# Altium project BLDC-Board-v1.0.PrjPcb (part 2 of 3)

## Sheet Controller_Sheet.SchDoc
size 420 x 297 mm; SheetNumber: 3; SheetTotal: 8
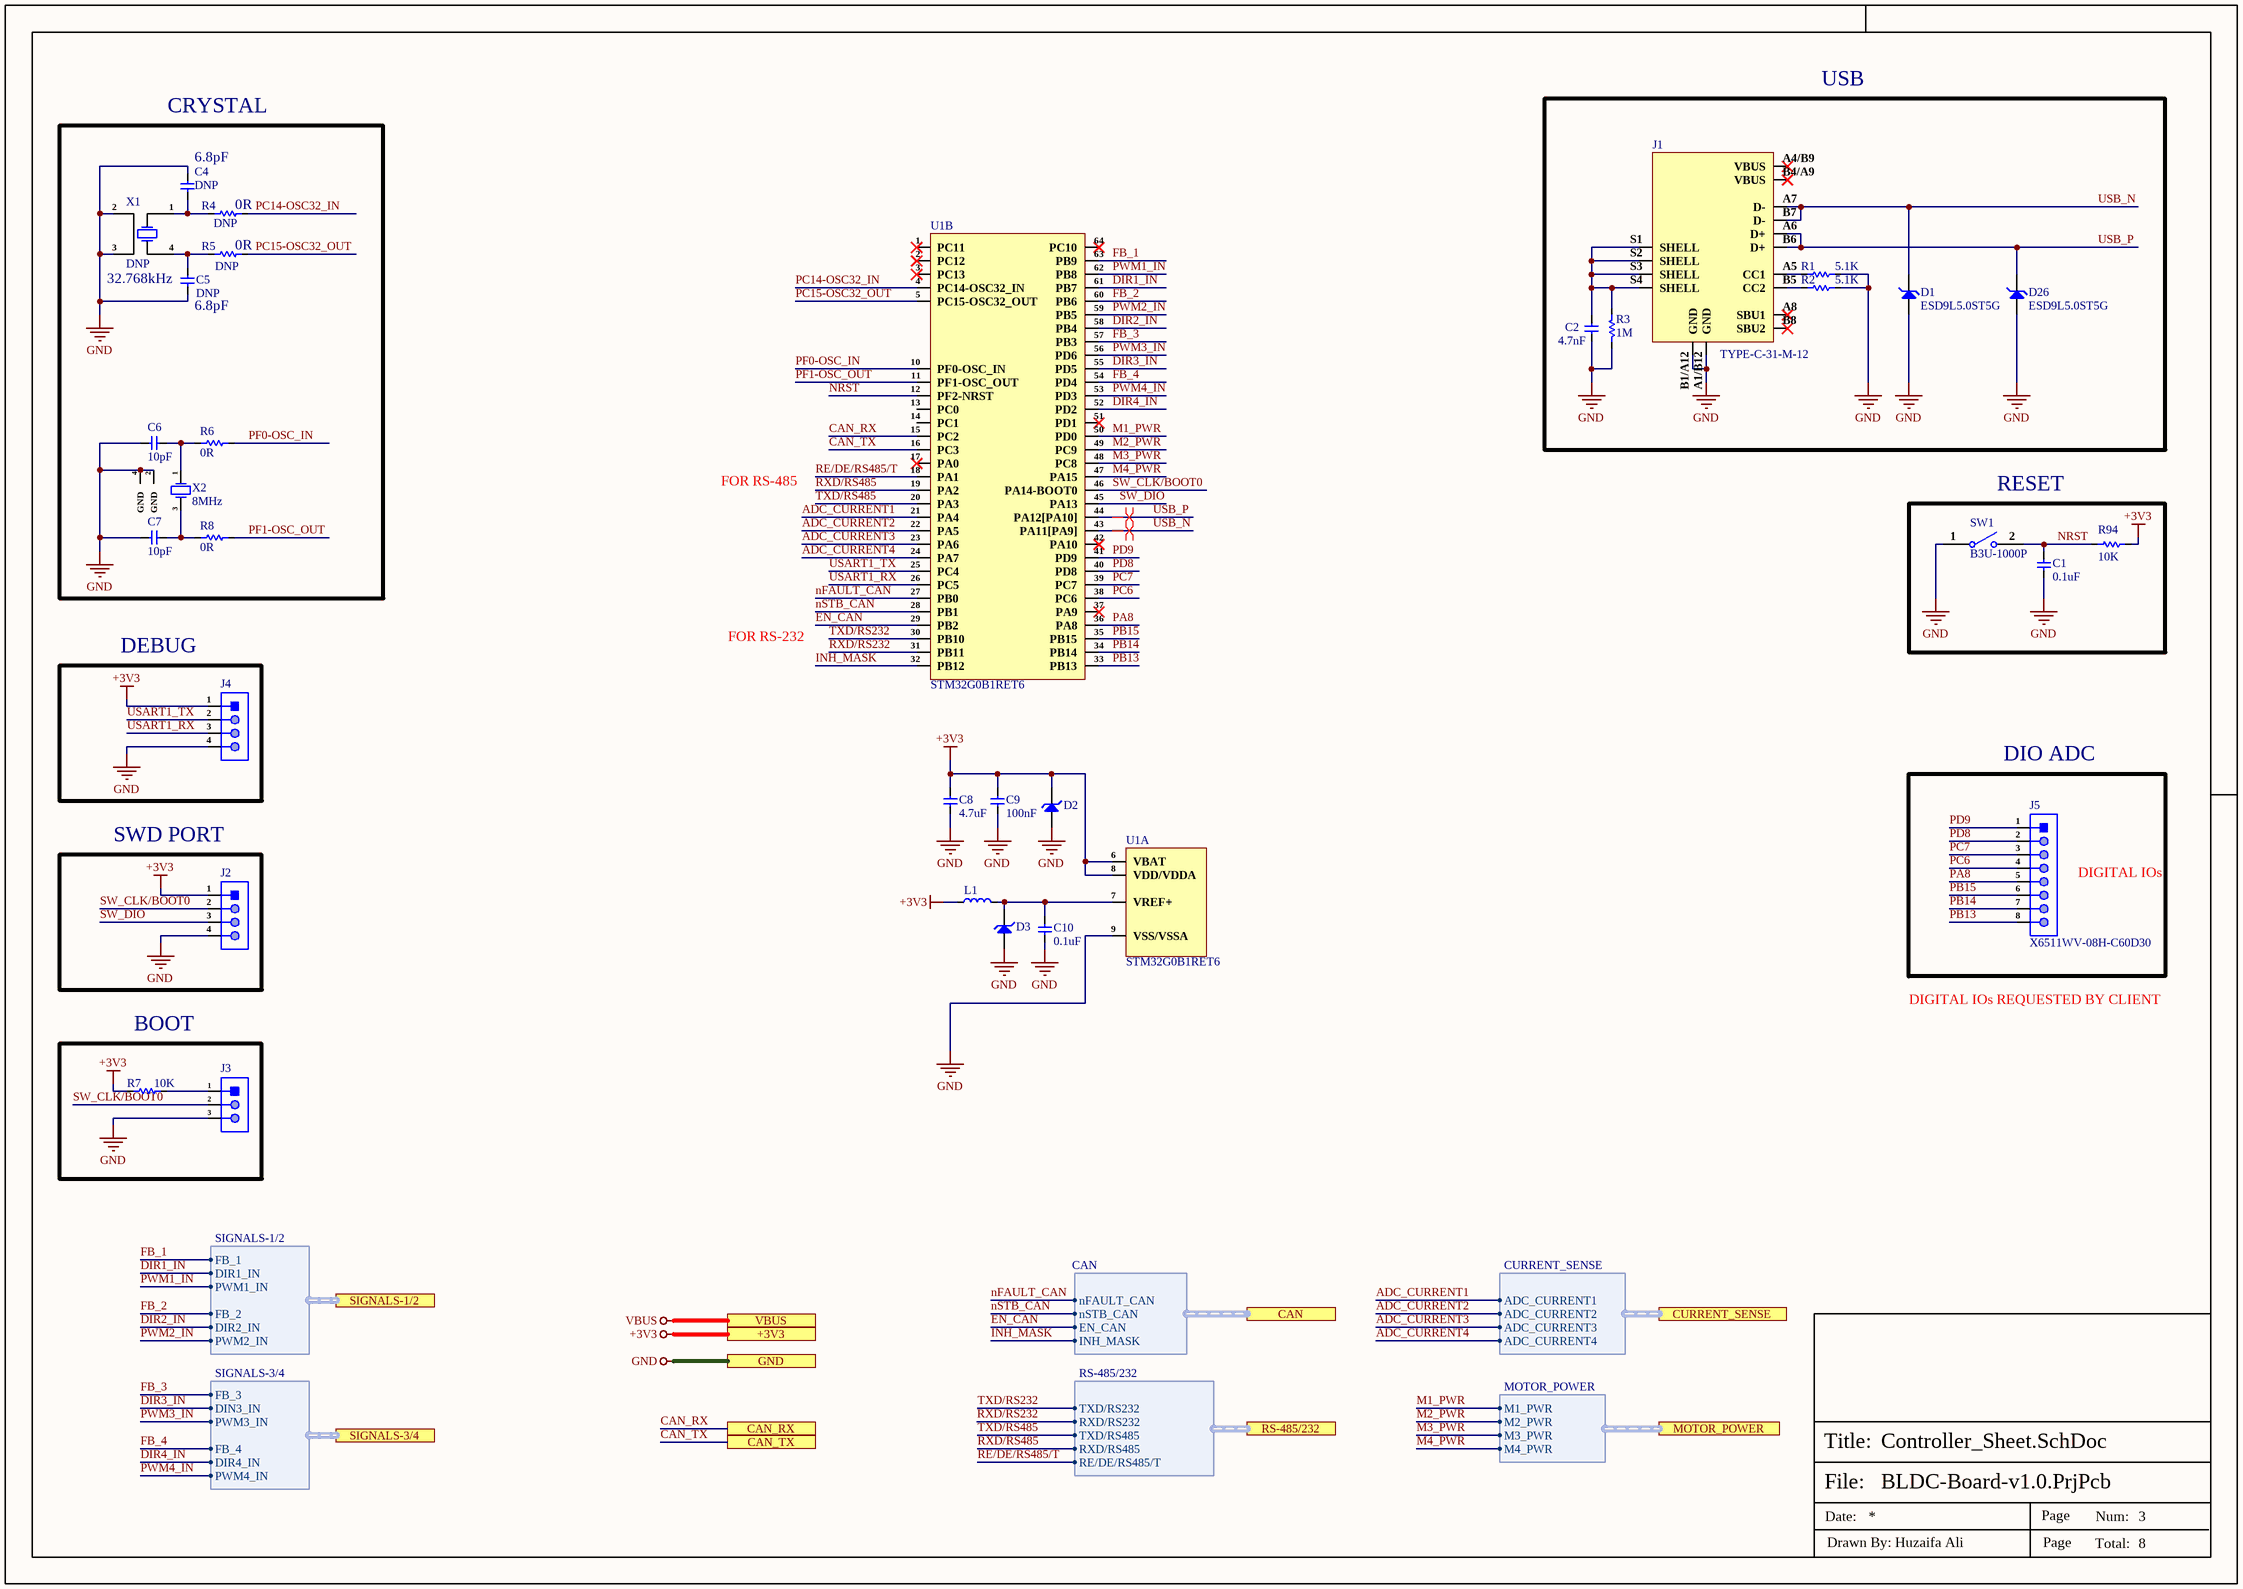
[diagram p4: Controller_Sheet.SchDoc]

### Parts
C1  0.1uF  [Cap-0402]
C2  4.7nF  [Cap-0603]
C4  DNP  [Cap-0402]
C5  DNP  [Cap-0402]
C6  10pF  [Cap-0402]
C7  10pF  [Cap-0402]
C8  4.7uF  [Cap-0402]
C9  100nF  [cap-0402]
C10  0.1uF  [Cap-0402]
D1  ESD9L5.0ST5G  [SOD-923.]
D2  AZ3003-01G  [SOD-123]  (value not drawn)
D3  AZ3003-01G  [SOD-123]  (value not drawn)
D26  ESD9L5.0ST5G  [SOD-923.]
J1  TYPE-C-31-M-12  [TYPE-C-31-M-12_]
J2  X6511WV-04H-C60D30  [HDR1X4_]  (value not drawn)
J3  68000-103HLF  [HDR1X3_]  (value not drawn)
J4  X6511WV-04H-C60D30  [HDR1X4_]  (value not drawn)
J5  X6511WV-08H-C60D30  [HDR 1x8 TH male]
L1  BLM15AG601SN1D  [IND-0402]  (value not drawn)
R1  5.1K  [Res-0402]
R2  5.1K  [Res-0402]
R3  1M  [Res-0402]
R4  DNP  [Res-0603]
R5  DNP  [Res-0603]
R6  0R  [Res-0603]
R7  10K  [Res-0402]
R8  0R  [Res-0603]
R94  10K  [Res-0402]
SW1  B3U-1000P  [B3U-1000P]
U1  STM32G0B1RET6  [LQFP-64(10x10)]  (parts A,B of 2)
X1  DNP  [MC-306]
X2  8MHz  [5TJ480000XYLBC_]

### Blocks framed on the sheet
USB: C2 D1 D26 J1 R1-R3
CRYSTAL: C4-C7 R4-R6 R8 X1 X2
RESET: C1 R94 SW1
DEBUG: J4
DIO ADC: J5
SWD PORT: J2
BOOT: J3 R7

### Ports
+3V3 (see Top_Sheet[3A], CAN_Sheet[5D], Connector_Sheet1[5D], Connector_Sheet2[3D], Motor_Driver_Sheet[5D], Power_Sheet[5D], RS485_RS232_Sheet[5D]), CAN (harness CAN, see Top_Sheet[4B], CAN_Sheet[3D]), CAN_RX (see Top_Sheet[4B], CAN_Sheet[2D]), CAN_TX (see Top_Sheet[4B], CAN_Sheet[2D]), CURRENT_SENSE (harness CURRENT_SENSE, see Top_Sheet[3B], Motor_Driver_Sheet[4D]), GND (see Top_Sheet[3B], CAN_Sheet[5D], Connector_Sheet1[5D], Connector_Sheet2[3D], Motor_Driver_Sheet[5D], Power_Sheet[5D], RS485_RS232_Sheet[5D]), MOTOR_POWER (harness MOTOR_POWER, see Top_Sheet[3B], Motor_Driver_Sheet[6D]), RS-485/232 (harness RS-485/232, see Top_Sheet[4B], RS485_RS232_Sheet[2D]), SIGNALS-1/2 (harness SIGNALS-1/2, see Top_Sheet[3B], Connector_Sheet1[1D]), SIGNALS-3/4 (harness SIGNALS-3/4, see Top_Sheet[4B], Connector_Sheet2[4D]), VBUS (see Top_Sheet[3A])

### Harnesses
CURRENT_SENSE: ADC_CURRENT1, ADC_CURRENT2, ADC_CURRENT3, ADC_CURRENT4
MOTOR_POWER: M1_PWR, M2_PWR, M3_PWR, M4_PWR
CAN: nFAULT_CAN, nSTB_CAN, EN_CAN, INH_MASK
RS-485/232: TXD/RS232, RXD/RS232, TXD/RS485, RXD/RS485, RE/DE/RS485/T
SIGNALS-3/4: FB_3, DIN3_IN, PWM3_IN, FB_4, DIR4_IN, PWM4_IN
SIGNALS-1/2: FB_1, DIR1_IN, PWM1_IN, FB_2, DIR2_IN, PWM2_IN

### Nets
+3V3: C8.2 C9.2 D2.2(K) J2.1 J4.1 L1.1 R7.2 R94.2 U1.6(VBAT) U1.8(VDD/VDDA) ; port +3V3
GND: C1.1 C2.1 C4.1 C5.2 C6.2 C7.2 C8.1 C9.1 C10.1 D1.2(A) D2.1(A) D3.1(A) D26.2(A) J1.A1/B12(GND) J1.B1/A12(GND) J2.4 J3.3 J4.4 R1.2 R2.2 R3.2 SW1.1 U1.9(VSS/VSSA) X1.2 X1.3 X2.2(GND) X2.4(GND) ; port GND
VBUS: port VBUS
ADC_CURRENT1: U1.21(PA4) ; port CURRENT_SENSE.ADC_CURRENT1
ADC_CURRENT2: U1.22(PA5) ; port CURRENT_SENSE.ADC_CURRENT2
ADC_CURRENT3: U1.23(PA6) ; port CURRENT_SENSE.ADC_CURRENT3
ADC_CURRENT4: U1.24(PA7) ; port CURRENT_SENSE.ADC_CURRENT4
CAN_RX: U1.15(PC2) ; port CAN_RX
CAN_TX: U1.16(PC3) ; port CAN_TX
DIR1_IN: U1.61(PB7) ; port SIGNALS-1/2.DIR1_IN
DIR2_IN: U1.58(PB4) ; port SIGNALS-1/2.DIR2_IN
DIR3_IN: U1.55(PD5) ; port SIGNALS-3/4.DIN3_IN
DIR4_IN: U1.52(PD2) ; port SIGNALS-3/4.DIR4_IN
EN_CAN: U1.29(PB2) ; port CAN.EN_CAN
FB_1: U1.63(PB9) ; port SIGNALS-1/2.FB_1
FB_2: U1.60(PB6) ; port SIGNALS-1/2.FB_2
FB_3: U1.57(PB3) ; port SIGNALS-3/4.FB_3
FB_4: U1.54(PD4) ; port SIGNALS-3/4.FB_4
INH_MASK: U1.32(PB12) ; port CAN.INH_MASK
M1_PWR: U1.50(PD0) ; port MOTOR_POWER.M1_PWR
M2_PWR: U1.49(PC9) ; port MOTOR_POWER.M2_PWR
M3_PWR: U1.48(PC8) ; port MOTOR_POWER.M3_PWR
M4_PWR: U1.47(PA15) ; port MOTOR_POWER.M4_PWR
nFAULT_CAN: U1.27(PB0) ; port CAN.nFAULT_CAN
NRST: C1.2 R94.1 SW1.2 U1.12(PF2-NRST)
nSTB_CAN: U1.28(PB1) ; port CAN.nSTB_CAN
PA8: J5.5 U1.36(PA8)
PB13: J5.8 U1.33(PB13)
PB14: J5.7 U1.34(PB14)
PB15: J5.6 U1.35(PB15)
PC6: J5.4 U1.38(PC6)
PC7: J5.3 U1.39(PC7)
PC14-OSC32_IN: R4.2 U1.4(PC14-OSC32_IN)
PC15-OSC32_OUT: R5.2 U1.5(PC15-OSC32_OUT)
PD8: J5.2 U1.40(PD8)
PD9: J5.1 U1.41(PD9)
PF0-OSC_IN: R6.2 U1.10(PF0-OSC_IN)
PF1-OSC_OUT: R8.2 U1.11(PF1-OSC_OUT)
PWM1_IN: U1.62(PB8) ; port SIGNALS-1/2.PWM1_IN
PWM2_IN: U1.59(PB5) ; port SIGNALS-1/2.PWM2_IN
PWM3_IN: U1.56(PD6) ; port SIGNALS-3/4.PWM3_IN
PWM4_IN: U1.53(PD3) ; port SIGNALS-3/4.PWM4_IN
RE/DE/RS485/T: U1.18(PA1) ; port RS-485/232.RE/DE/RS485/T
RXD/RS232: U1.31(PB11) ; port RS-485/232.RXD/RS232
RXD/RS485: U1.19(PA2) ; port RS-485/232.RXD/RS485
SW_CLK/BOOT0: J2.2 J3.2 U1.46(PA14-BOOT0)
SW_DIO: J2.3 U1.45(PA13)
TXD/RS232: U1.30(PB10) ; port RS-485/232.TXD/RS232
TXD/RS485: U1.20(PA3) ; port RS-485/232.TXD/RS485
USART1_RX: J4.3 U1.26(PC5)
USART1_TX: J4.2 U1.25(PC4)
USB_N: D1.1(K) J1.A7(D-) J1.B7(D-) U1.43(PA11[PA9])
USB_P: D26.1(K) J1.A6(D+) J1.B6(D+) U1.44(PA12[PA10])
NetC2_2: C2.2 J1.S1(SHELL) J1.S2(SHELL) J1.S3(SHELL) J1.S4(SHELL) R3.1
NetC4_2: C4.2 R4.1 X1.1(OSC1)
NetC5_1: C5.1 R5.1 X1.4(OSC2)
NetC6_1: C6.1 R6.1 X2.1(OSC1)
NetC7_1: C7.1 R8.1 X2.3(OSC2)
NetC10_2: C10.2 D3.2(K) L1.2 U1.7(VREF+)
NetJ1_A5: J1.A5(CC1) R1.1
NetJ1_B5: J1.B5(CC2) R2.1
NetJ3_1: J3.1 R7.1

Not connected (* = marked no-connect by the designer): J1 A4/B9(VBUS)* A8(SBU1)* B4/A9(VBUS)* B8(SBU2)*; U1 1(PC11)* 2(PC12)* 3(PC13)* 13(PC0) 14(PC1) 17(PA0)* 37(PA9)* 42(PA10)* 51(PD1)* 64(PC10)*

### Layout directives
differential pair; net class USB_PROGRAM; differential pair class USB_PROGRAM_LINES; rule Impedance Constraint [Min = 85.00    Max = 90.00    ]; rule Matched Net Lengths [Tolerance = 50mil]: USB_N, USB_P

### Notes on the sheet
- (near C4) 6.8pF
- (near R5) 0R
- (near R4) 0R
- 32.768kHz
- (near C5) 6.8pF
- FOR RS-485
- FOR RS-232
- (near J5) DIGITAL IOs
- DIGITAL IOs REQUESTED BY CLIENT
- File:
- Title:
- Date:
- Page
- Num:
- Total:
- Drawn By: Huzaifa Ali

### Library data of the parts
C1 C10 = CC0402JRX7R7BB104: CAP CER 0.1UF 16V X7R 0402; Manufacturer: Yageo; Material: 4241ConductorMaterial; Value: 100nF; Tolerance: 5%; Item Type: Capacitor; Supplier: Digikey; Supplier Part Number: 311-1676-1-ND; Manufacturer Part Number: CC0402JRX7R7BB104; RoHS: Yes; Category: Ceramic Capacitors; Stock: 1659111; Pricing: 1=0.1, 10=0.046, 50=0.0262, 100=0.0203, 500=0.01528, 1000=0.012, 2500=0.01091, 5000=0.01004 (USD); Mounting Technology: Surface Mount; Case/Package: 0402; Case Code (Metric): 1005; Case Code (Imperial): 0402; Min Operating Temperature: -55°C; Max Operating Temperature: 125°C; Dielectric: X7R; Packaging: Tape and Reel; Package Quantity: 10000; Voltage Rating (DC): 16V; Voltage Rating: 16V; Series: CC; Construction: Flat; Length: 0.039inch; Width: 0.02inch; Height: 0.5mm; Thickness: 0.022inch; Lead Free: Lead Free; Halogen Free: Halogen Free; RoHS Compliant: Yes; ComponentLink1URL: https://datasheet.ciiva.com/13210/upy-gphc-x7r-6-3v-to-50v-8-12304-13210152.pdf?src-supplier=Mouser; ComponentLink1Description: https://datasheet.ciiva.com/13210/upy-gphc-x7r-6-3v-to-50v-8-12304-13210152.pdf?src-supplier=Mouser; LCSC Part Number: C541464
C2 = CC0603JRNPO9BN472: CAP CER 4700PF 50V C0G/NPO 0603; Manufacturer: Yageo; Item Type: Capacitor; Supplier 1: Digi-Key; Manufacturer Part Number: CC0603JRNPO9BN472; RoHS: Yes; Category: Ceramic Capacitors; Stock 1: 31779; Pricing 1: 1=0.48000, 10=0.33000, 50=0.23100, 100=0.19800, 500=0.14854, 1000=0.12543 (USD); RoHS Compliant: Yes; Supplier Part Number 1: 13-CC0603JRNPO9BN472CT-ND; LCSC Part Number: C576818; ComponentLink1Description: LCSC; ComponentLink1URL: https://www.lcsc.com/product-detail/Multilayer-Ceramic-Capacitors-MLCC-SMD-SMT_YAGEO-CC0603JRNPO9BN472_C576818.html
C4 C5 = CC0402CRNPO9BN6R8: CAP CER 6.8PF 50V C0G/NPO 0402; Manufacturer: Yageo; Dielectric: C0G; Tolerance: 2%; Insulation Resistance: 10GR; Item Type: Capacitor; Supplier: Future Electronics; Supplier Part Number: 3247368; Manufacturer Part Number: CC0402CRNPO9BN6R8; RoHS: Yes; Category: Ceramic Capacitors; Stock: 200000; Pricing: 10000=0.0024, 40000=0.0022, 150000=0.0021, 400000=0.002, 1000000=0.0019 (USD); Mounting Technology: Surface Mount; Case/Package: 0402; Case Code (Imperial): 0402; Case Code (Metric): 1005; Weight: 2.3E-05oz; Min Operating Temperature: -55°C; Max Operating Temperature: 125°C; Value: 6.8pF; Packaging: Tape and Reel; Voltage Rating: 50V; Voltage Rating (DC): 50V; Termination: SMD/SMT; Series: CC; Construction: Flat; Length: 1mm; Width: 0.5mm; Height: 0.5mm; Depth: 0.5mm; Radiation Hardening: No; RoHS Compliant: Yes; ComponentLink1URL: https://datasheet.ciiva.com/11587/upy-gp-np0-16v-to-50v-8-11587182.pdf?src-supplier=Avnet; ComponentLink1Description: https://datasheet.ciiva.com/11587/upy-gp-np0-16v-to-50v-8-11587182.pdf?src-supplier=Avnet; LCSC Part Number: C189470
C6 C7 = GRM1555C1H100JA01D: CAP CER 10PF 50V C0G/NP0 0402; Manufacturer: Murata; Material: Ceramic; Dielectric: C0G; Tolerance: 5%; Item Type: Capacitor; Supplier: Arrow Electronics; Supplier Part Number: GRM1555C1H100JA01D; Manufacturer Part Number: GRM1555C1H100JA01D; RoHS: Yes; Category: Ceramic Capacitors; Stock: 3860000; Pricing: 10000=0.0034, 50000=0.0027, 100000=0.0023, 250000=0.0021 (USD); Mounting Technology: Surface Mount; Case/Package: 0402; Case Code (Metric): 1005; Case Code (Imperial): 0402; Min Operating Temperature: -55°C; Max Operating Temperature: 125°C; Value: 10pF; Voltage Rating: 50V; Packaging: Tape and Reel; Package Quantity: 1; Voltage Rating (DC): 50V; Termination: SMD/SMT; Series: GRM; Voltage: 50V; Construction: Flat; Length: 1mm; Width: 0.02inch; Height: 0.5mm; Depth: 0.5mm; Thickness: 0.022inch; Radiation Hardening: No; RoHS Compliant: Yes; Lead Free: Lead Free; Reach SVHC Compliant: No; ComponentLink1URL: https://datasheet.ciiva.com/2989/product-2989280.pdf?src-supplier=Avnet; ComponentLink1Description: https://datasheet.ciiva.com/2989/product-2989280.pdf?src-supplier=Avnet; ComponentLink2URL: https://datasheet.ciiva.com/18184/getdatasheetpartid-307234-18184164.pdf?src-supplier=Verical; ComponentLink2Description: https://datasheet.ciiva.com/18184/getdatasheetpartid-307234-18184164.pdf?src-supplier=Verical; ComponentLink3URL: https://datasheet.ciiva.com/29200/453545-da-01-en-vs-kondensator-0402-29200107.pdf?src-supplier=Conrad; ComponentLink3Description: https://datasheet.ciiva.com/29200/453545-da-01-en-vs-kondensator-0402-29200107.pdf?src-supplier=Conrad; ComponentLink4URL: https://datasheet.ciiva.com/7828/1666664-7828812.pdf?src-supplier=Element14; ComponentLink4Description: https://datasheet.ciiva.com/7828/1666664-7828812.pdf?src-supplier=Element14; ComponentLink5URL: https://datasheet.ciiva.com/6271/partnumbering-e-01-6271159.pdf?src-supplier=Digi-Key; ComponentLink5Description: https://datasheet.ciiva.com/6271/partnumbering-e-01-6271159.pdf?src-supplier=Digi-Key; ComponentLink6URL: https://datasheet.ciiva.com/6271/partnumbering-e-01-6271158.pdf?src-supplier=Digi-Key; ComponentLink6Description: https://datasheet.ciiva.com/6271/partnumbering-e-01-6271158.pdf?src-supplier=Digi-Key; ComponentLink7URL: https://datasheet.ciiva.com/6271/partnumbering-e-01-6271068.pdf?src-supplier=Digi-Key; ComponentLink7Description: https://datasheet.ciiva.com/6271/partnumbering-e-01-6271068.pdf?src-supplier=Digi-Key; LCSC Part Number: C76946
C8 = CC0402KRX5R6BB475: CAP CER 4.7UF 10V X5R 0402; Manufacturer: Yageo; Tolerance: 10%; Supplier 1: Farnell; Manufacturer Part Number: CC0402KRX5R6BB475; RoHS: Yes; Category: Ceramic Capacitors; Stock 1: 20000; Pricing 1: 10000=0.02310, 50000=0.02100 (GBP); Mount: Surface Mount; Case/Package: 0402; Case Code (Imperial): 0402; Case Code (Metric): 1005; Min Operating Temperature: -55°C; Max Operating Temperature: 85°C; Packaging: Cut Tape; Capacitance: 4.7uF; Voltage Rating: 10V; RoHS Compliant: Yes; ComponentLink1URL: http://www.yageo.com/documents/recent/UPY-GPHC_X5R_4V-to-50V_25.pdf?src-supplier=Digi-Key; ComponentLink1Description: http://www.yageo.com/documents/recent/UPY-GPHC_X5R_4V-to-50V_25.pdf?src-supplier=Digi-Key; Supplier Part Number 1: 3871698; LCSC Part Number: C326586
C9 = C1005X7R1H104KT000F: CAP CER 0.1UF 50V X7R 0402; Manufacturer: TDK; Tolerance: 10%; Voltage: 25V; Item Type: Capacitor; Supplier 1: Avnet; Manufacturer Part Number: C1005X7R1H104KT000F; RoHS: No; Category: Ceramic Capacitors; Dielectric: X7R; Supplier Part Number 1: C1005X7R1H104KT000F; LCSC Part Number: C361198; ComponentLink1Description: LCSC; ComponentLink1URL: https://www.lcsc.com/product-detail/Multilayer-Ceramic-Capacitors-MLCC-SMD-SMT_TDK-C1005X7R1H104KT000F_C361198.html
D1 D26 = ESD9L5.0ST5G: TVS DIODE 5V 9.8V SOD923; Manufacturer: ON Semiconductor; Capacitance: 0.9pF; Direction: Unidirectional; Number of Unidirectional Channels: 1; Min Breakdown Voltage: 5.4V; Power Line Protection: No; Leakage Current: 1uA; Element Configuration: Single; Peak Pulse Current: 1A; Diode Type: ZENER; Reverse Breakdown Voltage: 5.8V; Peak Pulse Power: 150mW; ESD Protection: Yes; Test Current: 1mA; Supplier 1: Digi-Key; Manufacturer Part Number: ESD9L5.0ST5G; RoHS: Yes; Category: ESD and Circuit Protection ICs; Stock 1: 558996; Pricing 1: 1=0.37000, 10=0.25600, 100=0.12500, 500=0.10426, 1000=0.07244, 2000=0.06278 (USD); Case/Package: SOD-923-2; Number of Pins: 2; Contact Plating: Tin,Matte; Min Operating Temperature: -55°C; Max Operating Temperature: 150°C; Package Quantity: 1; Packaging: Tape and Reel; Clamping Voltage: 9.8V; Reverse Standoff Voltage: 5V; Working Voltage: 5V; Resistor Type: Zener; Series: Automotive, AEC-Q101; Number of Elements: 1; Operating Supply Voltage: 5V; Max Surge Current: 1A; Breakdown Voltage: 5.4V; Number of Channels: 1; Polarity: Unidirectional; Termination: SMD/SMT; Max Reverse Leakage Current: 1uA; Max Breakdown Voltage: 5.4V; Number of Lines: 1; Power Dissipation: 150mW; Clamping Voltage-Max: 9.8V; Length: 0.8mm; Width: 0.65mm; Height: 0.4mm; Depth: 0.6mm; Radiation Hardening: No; Lead Free: Lead Free; RoHS Compliant: Yes; REACH SVHC: No SVHC; Halogen Free: Halogen Free; ComponentLink1URL: https://datasheet.ciiva.com/15143/getdatasheetpartid-185186-15143896.pdf?src-supplier=Verical; ComponentLink1Description: https://datasheet.ciiva.com/15143/getdatasheetpartid-185186-15143896.pdf?src-supplier=Verical; ComponentLink2URL: https://datasheet.ciiva.com/4510/esd9l-d-4510647.pdf?src-supplier=Mouser; ComponentLink2Description: https://datasheet.ciiva.com/4510/esd9l-d-4510647.pdf?src-supplier=Mouser; ComponentLink3URL: https://datasheet.ciiva.com/3304/esd9l-d-3304011.pdf?src-supplier=Avnet; ComponentLink3Description: https://datasheet.ciiva.com/3304/esd9l-d-3304011.pdf?src-supplier=Avnet; ComponentLink4URL: https://datasheet.ciiva.com/16437/esd9l-d-16437835.pdf?src-supplier=Future+Electronics; ComponentLink4Description: https://datasheet.ciiva.com/16437/esd9l-d-16437835.pdf?src-supplier=Future+Electronics; ComponentLink5URL: https://datasheet.ciiva.com/339/esd9l-d-339853.pdf?src-supplier=Digi-Key; ComponentLink5Description: https://datasheet.ciiva.com/339/esd9l-d-339853.pdf?src-supplier=Digi-Key; ComponentLink6URL: https://datasheet.ciiva.com/339/esd9l-d-339854.pdf?src-supplier=Digi-Key; ComponentLink6Description: https://datasheet.ciiva.com/339/esd9l-d-339854.pdf?src-supplier=Digi-Key; ComponentLink7URL: https://datasheet.ciiva.com/11195/esd9l-d-11195342.pdf?src-supplier=Avnet; ComponentLink7Description: https://datasheet.ciiva.com/11195/esd9l-d-11195342.pdf?src-supplier=Avnet; ComponentLink8URL: https://datasheet.ciiva.com/25958/esd9l-d-25958446.pdf?src-supplier=Avnet+Europe; ComponentLink8Description: https://datasheet.ciiva.com/25958/esd9l-d-25958446.pdf?src-supplier=Avnet+Europe; ComponentLink9URL: https://datasheet.ciiva.com/339/esd9l-d-339855.pdf?src-supplier=Digi-Key; ComponentLink9Description: https://datasheet.ciiva.com/339/esd9l-d-339855.pdf?src-supplier=Digi-Key; Supplier Part Number 1: ESD9L5.0ST5GOSCT-ND; LCSC Part Number: C82326
D2 D3 = AZ3003-01G: TVS SURGE PROTECTOR 1-CH 3.3V; Manufacturer: Amazing; Item Type: Diode; Manufacturer Part Number: AZ3003-01G; Package: SOD-123; LCSC Part Number: -; ComponentLink1Description: Digikey; ComponentLink1URL: https://www.digikey.com/en/products/detail/amazing/AZ3003-01G/16615352?s=N4IgTCBcDaIIIC0DMAGFSC0KCMBxEAugL5A
J1 = TYPE-C-31-M-12: 5A 1 16P Female Type-C SMD USB Connectors ROHS; Manufacturer: Korean Hroparts Elec; ComponentLink1Description: LCSC; ComponentLink1URL: https://www.lcsc.com/product-detail/USB-Connectors_Korean-Hroparts-Elec-TYPE-C-31-M-12_C165948.html; Manufacturer Part Number: TYPE-C-31-M-12; Footprint: Custom; LCSC Part Number: C165948; Item Type: USB Connector
J2 J4 = X6511WV-04H-C60D30: Gold 250V 3A Straight Square Pins 2.5mm 4P 260℃ 6mm -40℃~+105℃ 3mm 2.54mm Plugin Black Brass 1x4P Plugin,P=2.54mm Pin Headers ROHS; Manufacturer: XKB; Item Type: Male Header; ComponentLink1Description: LCSC; ComponentLink1URL: https://www.lcsc.com/product-detail/Pin-Headers_XKB-Connectivity-X6511WV-04H-C60D30_C706876.html; Manufacturer Part Number: X6511WV-04H-C60D30; Package: Plugin,P=2.54mm; LCSC Part Number: C706876
J3 = 68000-103HLF: CONN HEADER VERT 3POS 2.54MM; Item Type: Male Header; Number of Positions: 3; Current Rating: 3A; Insulation Resistance: 5GR; Voltage Rating: 1.5kV; Contact Post Length: 2.41mm; LCSC Part Number: C168677; ComponentLink1Description: LCSC; Supplier: Avnet; Supplier Part Number: 88K1775; RoHS: No; Category: Headers and Wire Housings; Stock: 2805; Pricing: 1=0.395, 10=0.31, 25=0.29, 50=0.27, 100=0.25 (USD); Contact Plating: Gold,GXT; Contact Material: Bronze; Housing Material: Thermoplastic; Housing Color: Black; Min Operating Temperature: -65°C; Max Operating Temperature: 125°C; Number of Rows: 1; Termination: Through Hole; Packaging: Bulk; Number of Contacts: 3; Contact Gender: Male; Orientation: Straight; Max Voltage Rating (AC): 1.5kV; Package Quantity: 100; Series: 68000; Length: 7.62mm; Pitch: 2.54mm; Contact Mating Length: 5.84mm; Depth: 2.41mm; Radiation Hardening: No; Flammability Rating: UL94 V-0; Reach SVHC Compliant: No; ComponentLink2URL: https://datasheet.ciiva.com/46392/1914865-46392021.pdf?src-supplier=Element14; ComponentLink2Description: https://datasheet.ciiva.com/46392/1914865-46392021.pdf?src-supplier=Element14
J5 = X6511WV-08H-C60D30: Gold 250V 3A Square Pins 2.5mm 8P 260℃ 6mm -40℃~+105℃ 3mm 2.54mm Plugin Black Brass 2.54mm 1x8P Plugin,P=2.54mm Pin Headers ROHS; Manufacturer: XKB; Item Type: Male Header; Manufacturer Part Number: X6511WV-08H-C60D30; Package: Plugin,P=2.54mm; LCSC Part Number: C706880; ComponentLink1Description: LCSC; ComponentLink1URL: https://www.lcsc.com/product-detail/Pin-Headers_XKB-Connection-X6511WV-08H-C60D30_C706880.html
L1 = BLM15AG601SN1D: FERRITE BEAD 600 OHM 0402 1LN; Manufacturer: Murata; Material: Steel,Ferrite; Impedance: 600R; Tolerance: 25%; Max DC Current: 300mA; DC Resistance (DCR): 520mR; Test Frequency: 100MHz; Number of Lines: 1; Shielding: Unshielded; DC Resistance-Max: 600mR; Supplier 1: Digi-Key; Manufacturer Part Number: BLM15AG601SN1D; RoHS: Yes; Category: Inductors; Stock 1: 4108655; Pricing 1: 1=0.10000, 10=0.06500, 25=0.05760, 50=0.05240, 100=0.04710, 250=0.03456, 500=0.02514, 1000=0.02461, 5000=0.01676 (USD); Case/Package: 0402; Number of Pins: 2; Core Material: Ferrite; Case Code (Metric): 1005; Case Code (Imperial): 0402; Min Operating Temperature: -55°C; Max Operating Temperature: 125°C; Package Quantity: 10000; Packaging: Tape and Reel; Current Rating: 300mA; Max Current Rating: 300mA; Termination: SMD/SMT; DC Current: 300mA; Frequency: 100MHz; Number of Circuits: 1; Series: BLM15AG_SN; Length: 1mm; Width: 0.5mm; Height: 0.5mm; Depth: 0.55mm; Radiation Hardening: No; REACH SVHC: No SVHC; Military Standard: Not; Lead Free: Lead Free; RoHS Compliant: Yes; ComponentLink1URL: https://datasheet.ciiva.com/11799/0900766b811b5866-11799226.pdf?src-supplier=RSComponents; ComponentLink1Description: https://datasheet.ciiva.com/11799/0900766b811b5866-11799226.pdf?src-supplier=RSComponents; ComponentLink2URL: https://datasheet.ciiva.com/41449/001172163-da-01-en-drossel-0402-600r-1-0x0-5mm-10000st-41449450.pdf?src-supplier=Conrad; ComponentLink2Description: https://datasheet.ciiva.com/41449/001172163-da-01-en-drossel-0402-600r-1-0x0-5mm-10000st-41449450.pdf?src-supplier=Conrad; ComponentLink3URL: https://datasheet.ciiva.com/29347/442210-da-01-en-chip-drossel-0402-600r-300ma-1-0x0-5mm-29347879.pdf?src-supplier=Conrad; ComponentLink3Description: https://datasheet.ciiva.com/29347/442210-da-01-en-chip-drossel-0402-600r-300ma-1-0x0-5mm-29347879.pdf?src-supplier=Conrad; ComponentLink4URL: https://datasheet.ciiva.com/1466/5144-1466744.pdf?src-supplier=Element14; ComponentLink4Description: https://datasheet.ciiva.com/1466/5144-1466744.pdf?src-supplier=Element14; ComponentLink5URL: https://datasheet.ciiva.com/1466/5144-1466745.pdf?src-supplier=Element14; ComponentLink5Description: https://datasheet.ciiva.com/1466/5144-1466745.pdf?src-supplier=Element14; ComponentLink6URL: https://datasheet.ciiva.com/14122/blm-series-eng-tds-14122894.pdf?src-supplier=Distrelec; ComponentLink6Description: https://datasheet.ciiva.com/14122/blm-series-eng-tds-14122894.pdf?src-supplier=Distrelec; ComponentLink7URL: https://datasheet.ciiva.com/6212/l0110s0100blm15ag-sn-6212519.pdf?src-supplier=Digi-Key; ComponentLink7Description: https://datasheet.ciiva.com/6212/l0110s0100blm15ag-sn-6212519.pdf?src-supplier=Digi-Key; ComponentLink8URL: https://datasheet.ciiva.com/6212/l0110s0100blm15ag-sn-6212565.pdf?src-supplier=Digi-Key; ComponentLink8Description: https://datasheet.ciiva.com/6212/l0110s0100blm15ag-sn-6212565.pdf?src-supplier=Digi-Key; ComponentLink9URL: https://datasheet.ciiva.com/6212/l0110s0100blm15ag-sn-6212520.pdf?src-supplier=Digi-Key; ComponentLink9Description: https://datasheet.ciiva.com/6212/l0110s0100blm15ag-sn-6212520.pdf?src-supplier=Digi-Key; ComponentLink10URL: https://datasheet.ciiva.com/8084/l0110s0100blm15ag-sn-8084271.pdf?src-supplier=Avnet; ComponentLink10Description: https://datasheet.ciiva.com/8084/l0110s0100blm15ag-sn-8084271.pdf?src-supplier=Avnet; ComponentLink11URL: https://datasheet.ciiva.com/8510/l0110s0100blm15ag-sn-8510909.pdf?src-supplier=Avnet; ComponentLink11Description: https://datasheet.ciiva.com/8510/l0110s0100blm15ag-sn-8510909.pdf?src-supplier=Avnet; Supplier Part Number 1: 490-1006-1-ND; LCSC Part Number: C76884; Item Type: Ferrite Bead
R1 R2 = RC0402FR-075K1L: RES 5.1K OHM 1% 1/16W 0402; Manufacturer: Yageo; Power Rating: 63mW; Resistance: 5.1kR; Temperature Coefficient: 100ppm/°C; Voltage Rating: 50V; Item Type: Resistor; Supplier 1: Avnet; Manufacturer Part Number: RC0402FR-075K1L; RoHS: Yes; Category: Chip SMD Resistors; Stock 1: 65000; Pricing 1: 10000=0.00085 (USD); Case/Package: 0402; Case Code (Metric): 1005; Case Code (Imperial): 0402; Min Operating Temperature: -55°C; Max Operating Temperature: 155°C; Tolerance: 1%; Technology: THICK FILM; Packaging: Tape and Reel; Package Quantity: 1; Resistor Type: Thick Film; Number of Terminations: 2; Termination: SMD/SMT; Max Power Dissipation: 63mW; Voltage Rating (DC): 50V; Working Voltage: 50V; Features: Moisture Resistant; Series: RC; Resistance Tolerance: 1%; Construction: Rectangular; Length: 1mm; Width: 0.02inch; Height: 0.016inch; Depth: 0.5mm; RoHS Compliant: Yes; Military Standard: Not; Lead Free: Lead Free; ComponentLink1URL: https://datasheet.ciiva.com/7983/1018594-7983519.pdf?src-supplier=Element14; ComponentLink1Description: https://datasheet.ciiva.com/7983/1018594-7983519.pdf?src-supplier=Element14; ComponentLink2URL: https://datasheet.ciiva.com/46394/1018594-46394936.pdf?src-supplier=Element14; ComponentLink2Description: https://datasheet.ciiva.com/46394/1018594-46394936.pdf?src-supplier=Element14; ComponentLink3URL: https://datasheet.ciiva.com/2453/pyu-r-int-thick-7-2453401.pdf?src-supplier=Digi-Key; ComponentLink3Description: https://datasheet.ciiva.com/2453/pyu-r-int-thick-7-2453401.pdf?src-supplier=Digi-Key; ComponentLink4URL: https://datasheet.ciiva.com/2453/pyu-r-int-thick-7-2453402.pdf?src-supplier=Digi-Key; ComponentLink4Description: https://datasheet.ciiva.com/2453/pyu-r-int-thick-7-2453402.pdf?src-supplier=Digi-Key; ComponentLink5URL: https://datasheet.ciiva.com/2453/pyu-r-int-thick-7-2453400.pdf?src-supplier=Digi-Key; ComponentLink5Description: https://datasheet.ciiva.com/2453/pyu-r-int-thick-7-2453400.pdf?src-supplier=Digi-Key; ComponentLink6URL: https://datasheet.ciiva.com/12558/pyu-rc0402-51-rohs-l-6-r-8721-12558460.pdf?src-supplier=Mouser; ComponentLink6Description: https://datasheet.ciiva.com/12558/pyu-rc0402-51-rohs-l-6-r-8721-12558460.pdf?src-supplier=Mouser; ComponentLink7URL: https://datasheet.ciiva.com/16744/pyu-rc0402-51-rohs-l-6-r-16744283.pdf?src-supplier=Future+Electronics; ComponentLink7Description: https://datasheet.ciiva.com/16744/pyu-rc0402-51-rohs-l-6-r-16744283.pdf?src-supplier=Future+Electronics; ComponentLink8URL: https://datasheet.ciiva.com/15189/getdatasheetpartid-323636-15189493.pdf?src-supplier=Verical; ComponentLink8Description: https://datasheet.ciiva.com/15189/getdatasheetpartid-323636-15189493.pdf?src-supplier=Verical; Supplier Part Number 1: RC0402FR-075K1L; LCSC Part Number: C105872
R3 = AF0402JR-071ML: RES SMD 1M OHM 5% 1/16W 0402; Manufacturer: Yageo; Resistance: 1MR; Max Power Dissipation: 63mW; Temperature Coefficient: 100ppm/°C; Item Type: Resistor; Supplier 1: Digi-Key; Manufacturer Part Number: AF0402JR-071ML; Stock 1: 0; Pricing 1: 10000=0.00408 (USD); Case/Package: 0402; Min Operating Temperature: -55°C; Max Operating Temperature: 155°C; Packaging: Tape and Reel; Resistor Type: Thick Film; Number of Terminations: 2; Tolerance: 5%; Features: Moisture Resistant,Anti-Sulfur; Length: 0.039inch; Width: 0.02inch; Height: 0.015inch; RoHS Compliant: Yes; ComponentLink1URL: https://www.yageo.com/upload/media/product/productsearch/datasheet/rchip/PYu-AF_51_RoHS_L_6.pdf?src-supplier=Digi-Key; ComponentLink1Description: https://www.yageo.com/upload/media/product/productsearch/datasheet/rchip/PYu-AF_51_RoHS_L_6.pdf?src-supplier=Digi-Key; Supplier Part Number 1: AF0402JR-071ML-ND; LCSC Part Number: C144054
R4-R6 R8 = RC0603JR-070RL: RES 0 OHM JUMPER 1/10W 0603; Manufacturer: Yageo; Resistance: 0mR; Tolerance: 1%; Power Rating: 100mW; Voltage Rating (DC): 50V; Temperature Coefficient: 200ppm/°C; Resistance Tolerance: 5%; Item Type: Resistor; Supplier 1: Digi-Key; Manufacturer Part Number: RC0603JR-070RL; RoHS: Yes; Category: Chip SMD Resistors; Stock 1: 18081776; Pricing 1: 1=0.10000, 10=0.01700, 25=0.01240, 50=0.00960, 100=0.00700, 250=0.00536, 500=0.00430, 1000=0.00316 (USD); Case/Package: 0603; Number of Pins: 2; Contact Plating: Tin,Matte; Case Code (Imperial): 0603; Case Code (Metric): 1608; Size Code: 0603; Min Operating Temperature: -55°C; Max Operating Temperature: 155°C; Resistor Type: Thick Film; Packaging: Tape and Reel; Termination: SMD/SMT; Series: RC; Technology: THICK FILM; Package Quantity: 5000; Voltage Rating: 50V; Features: Moisture Resistant; Max Power Dissipation: 100mW; Number of Terminations: 2; Construction: Rectangular; Length: 1.6mm; Width: 0.8mm; Height: 0.45mm; Depth: 0.8mm; Radiation Hardening: No; Reach SVHC Compliant: No SVHC; Lead Free: Lead Free; RoHS Compliant: Yes; Military Standard: Not; Supplier Part Number 1: 311-0.0GRCT-ND; LCSC Part Number: C95177
R7 R94 = RC0402FR-0710KL: RES 10K OHM 1% 1/16W 0402; Manufacturer: Yageo; Resistance: 10kR; Voltage Rating (DC): 50V; Temperature Coefficient: 100ppm/°C; Power Rating: 62.5mW; Max Power Dissipation: 63mW; Item Type: Resistor; Supplier 1: Mouser; Manufacturer Part Number: RC0402FR-0710KL; RoHS: Yes; Category: Chip SMD Resistors; Stock 1: 18648329; Pricing 1: 1=0.10000, 10=0.01400, 50=0.01400, 100=0.00500, 1000=0.00300, 10000=0.00200 (USD); Case/Package: 0402; Number of Pins: 2; Case Code (Imperial): 0402; Case Code (Metric): 1005; Min Operating Temperature: -55°C; Max Operating Temperature: 155°C; Resistor Type: Thick Film; Tolerance: 1%; Packaging: Tape and Reel; Voltage Rating: 50V; Termination: SMD/SMT; Working Voltage: 50V; Number of Terminations: 2; Features: Moisture Resistant; Series: RC; Resistance Tolerance: 1%; Construction: Rectangular; Length: 1mm; Width: 0.5mm; Height: 0.32mm; Depth: 0.5mm; Lead Pitch: 0.2mm; REACH SVHC: No SVHC; Lead Free: Lead Free; RoHS Compliant: Yes; Military Standard: Not; ComponentLink1URL: https://datasheet.ciiva.com/7660/38568-7660787.pdf?src-supplier=Element14; ComponentLink1Description: https://datasheet.ciiva.com/7660/38568-7660787.pdf?src-supplier=Element14; ComponentLink2URL: https://datasheet.ciiva.com/7849/1686128-7849814.pdf?src-supplier=Element14; ComponentLink2Description: https://datasheet.ciiva.com/7849/1686128-7849814.pdf?src-supplier=Element14; ComponentLink3URL: https://datasheet.ciiva.com/7983/1018594-7983486.pdf?src-supplier=Element14; ComponentLink3Description: https://datasheet.ciiva.com/7983/1018594-7983486.pdf?src-supplier=Element14; ComponentLink4URL: https://datasheet.ciiva.com/22747/1018594-22747512.pdf?src-supplier=Element14; ComponentLink4Description: https://datasheet.ciiva.com/22747/1018594-22747512.pdf?src-supplier=Element14; ComponentLink5URL: https://datasheet.ciiva.com/12667/pyu-rc0402-51-rohs-l-6-r-12667067.pdf?src-supplier=Mouser; ComponentLink5Description: https://datasheet.ciiva.com/12667/pyu-rc0402-51-rohs-l-6-r-12667067.pdf?src-supplier=Mouser; ComponentLink6URL: https://datasheet.ciiva.com/7849/1784430-7849813.pdf?src-supplier=Element14; ComponentLink6Description: https://datasheet.ciiva.com/7849/1784430-7849813.pdf?src-supplier=Element14; ComponentLink7URL: https://datasheet.ciiva.com/7849/1784430-7849815.pdf?src-supplier=Element14; ComponentLink7Description: https://datasheet.ciiva.com/7849/1784430-7849815.pdf?src-supplier=Element14; Supplier Part Number 1: 603-RC0402FR-0710KL; LCSC Part Number: C60490
SW1 = B3U-1000P: SWITCH TACTILE SPST-NO 0.05A 12V; Manufacturer: Omron; Mechanical Life: 200000Cycles; Operating Force: 1.5N; Throw Configuration: SPST; Current Rating: 50mA; Contact Resistance: 100mR; Illumination Type: Non-Illuminated,Illuminated; Switch Travel: 0.15mm; Switch Function: Off-Mom; Actuator Type: Standard; Actuator Length: 0.4mm; Ratings: Dust Proof,IP40; ComponentLink1URL: http://www.farnell.com/datasheets/60838.pdf?src-supplier=Farnell; ComponentLink1Description: http://www.farnell.com/datasheets/60838.pdf?src-supplier=Farnell; ComponentLink2URL: http://www.farnell.com/datasheets/60838.pdf?src-supplier=Element14; ComponentLink2Description: http://www.farnell.com/datasheets/60838.pdf?src-supplier=Element14; ComponentLink3URL: https://omronfs.omron.com/en_US/ecb/products/pdf/en-b3u.pdf?src-supplier=Digi-Key; ComponentLink3Description: https://omronfs.omron.com/en_US/ecb/products/pdf/en-b3u.pdf?src-supplier=Digi-Key; ComponentLink4URL: http://www.omron.com/ecb/products/pdf/en-b3u.pdf?src-supplier=Digi-Key; ComponentLink4Description: http://www.omron.com/ecb/products/pdf/en-b3u.pdf?src-supplier=Digi-Key; ComponentLink5URL: https://www.distrelec.biz/Web/Downloads/he/et/B3U_eng_datasheet.pdf?mime=application%2Fpdf&src-supplier=Distrelec; ComponentLink5Description: https://www.distrelec.biz/Web/Downloads/he/et/B3U_eng_datasheet.pdf?mime=application%2Fpdf&src-supplier=Distrelec; ComponentLink6URL: http://www.onlinecomponents.com/productFiles/mf-OM/en-b3u.pdf?src-supplier=Onlinecomponents.com; ComponentLink6Description: http://www.onlinecomponents.com/productFiles/mf-OM/en-b3u.pdf?src-supplier=Onlinecomponents.com; Supplier 1: Digi-Key; Manufacturer Part Number: B3U-1000P; Stock 1: 116454; Pricing 1: 1=1, 10=0.961, 25=0.9064, 50=0.7976, 100=0.7251, 250=0.68888, 500=0.67074, 1000=0.52571 (USD); Mount: Surface Mount; Weight: 0.000776oz; Contact Material: Silver; Min Operating Temperature: -25°C; Max Operating Temperature: 70°C; Packaging: Tape and Reel; Voltage Rating (DC): 12V; Package Quantity: 1; Max Current Rating: 50mA; Termination: SMD/SMT; Orientation: Straight; Max Voltage Rating (DC): 12V; Electrical Life: 200000Cycles; Insulation Resistance: 100MR; Contact Current Rating: 50mA; Length: 4mm; Height: 1.2mm; Depth: 2.5mm; Width: 3mm; REACH SVHC: Unknown; Lead Free: Lead Free; ComponentLink7URL: https://www.verical.com/server-webapp/html/getDatasheet?partID=552554&src-supplier=Verical; ComponentLink7Description: https://www.verical.com/server-webapp/html/getDatasheet?partID=552554&src-supplier=Verical; ComponentLink8URL: http://www.farnell.com/datasheets/1685550.pdf?src-supplier=Element14; ComponentLink8Description: http://www.farnell.com/datasheets/1685550.pdf?src-supplier=Element14; ComponentLink9URL: http://www.farnell.com/datasheets/2610940.pdf?src-supplier=Farnell; ComponentLink9Description: http://www.farnell.com/datasheets/2610940.pdf?src-supplier=Farnell; ComponentLink10URL: https://www.alliedelec.com/m/d/4c8a9ef82804fc3c241a13c1e298fd73.pdf?src-supplier=Allied+Electronics; ComponentLink10Description: https://www.alliedelec.com/m/d/4c8a9ef82804fc3c241a13c1e298fd73.pdf?src-supplier=Allied+Electronics; Supplier Part Number 1: SW1020DKR-ND; LCSC Part Number: C231329; Item Type: Switch
U1 = STM32G0B1RET6: IC MCU 32BIT 512KB FLASH 64LQFP; Manufacturer: STMicroelectronics; Item Type: Microcontrollers; Supplier: Future Electronics; Supplier Part Number: 4135249; Manufacturer Part Number: STM32G0B1RET6; RoHS: Yes; Stock: 320; Pricing: 160=3.74, 320=3.68, 480=3.64, 640=3.62, 800=3.54 (USD); LCSC Part Number: C2829307
X1 = MC-306 32.7680K-A0:ROHS: 32.768kHz 12.5pF ±20ppm MC-306 Crystals ROHS; Manufacturer: Seiko Epson; Value: 32.786kHz; Manufacturer Part Number: MC-306 32.7680K-A0:ROHS; Item Type: Crystal; LCSC Part Number: C2650464; ComponentLink1Description: LCSC; ComponentLink1URL: https://www.lcsc.com/product-detail/Crystals_Seiko-Epson-MC-306-32-7680K-A0-ROHS_C2650464.html
X2 = 5TJ480000XYLBC: 8MHz 18pF ±10ppm SMD5032-4P Crystals ROHS; Manufacturer: JYJE; Manufacturer Part Number: 5TJ480000XYLBC; ComponentLink1Description: LCSC; ComponentLink1URL: https://www.lcsc.com/product-detail/Crystals_JYJE-5TJ480000XYLBC_C2149247.html; Package: SMD5032-4P; LCSC Part Number: C2149247; Item Type: Crystal

## Sheet Motor_Driver_Sheet.SchDoc
size 420 x 297 mm; SheetNumber: 6; SheetTotal: 8
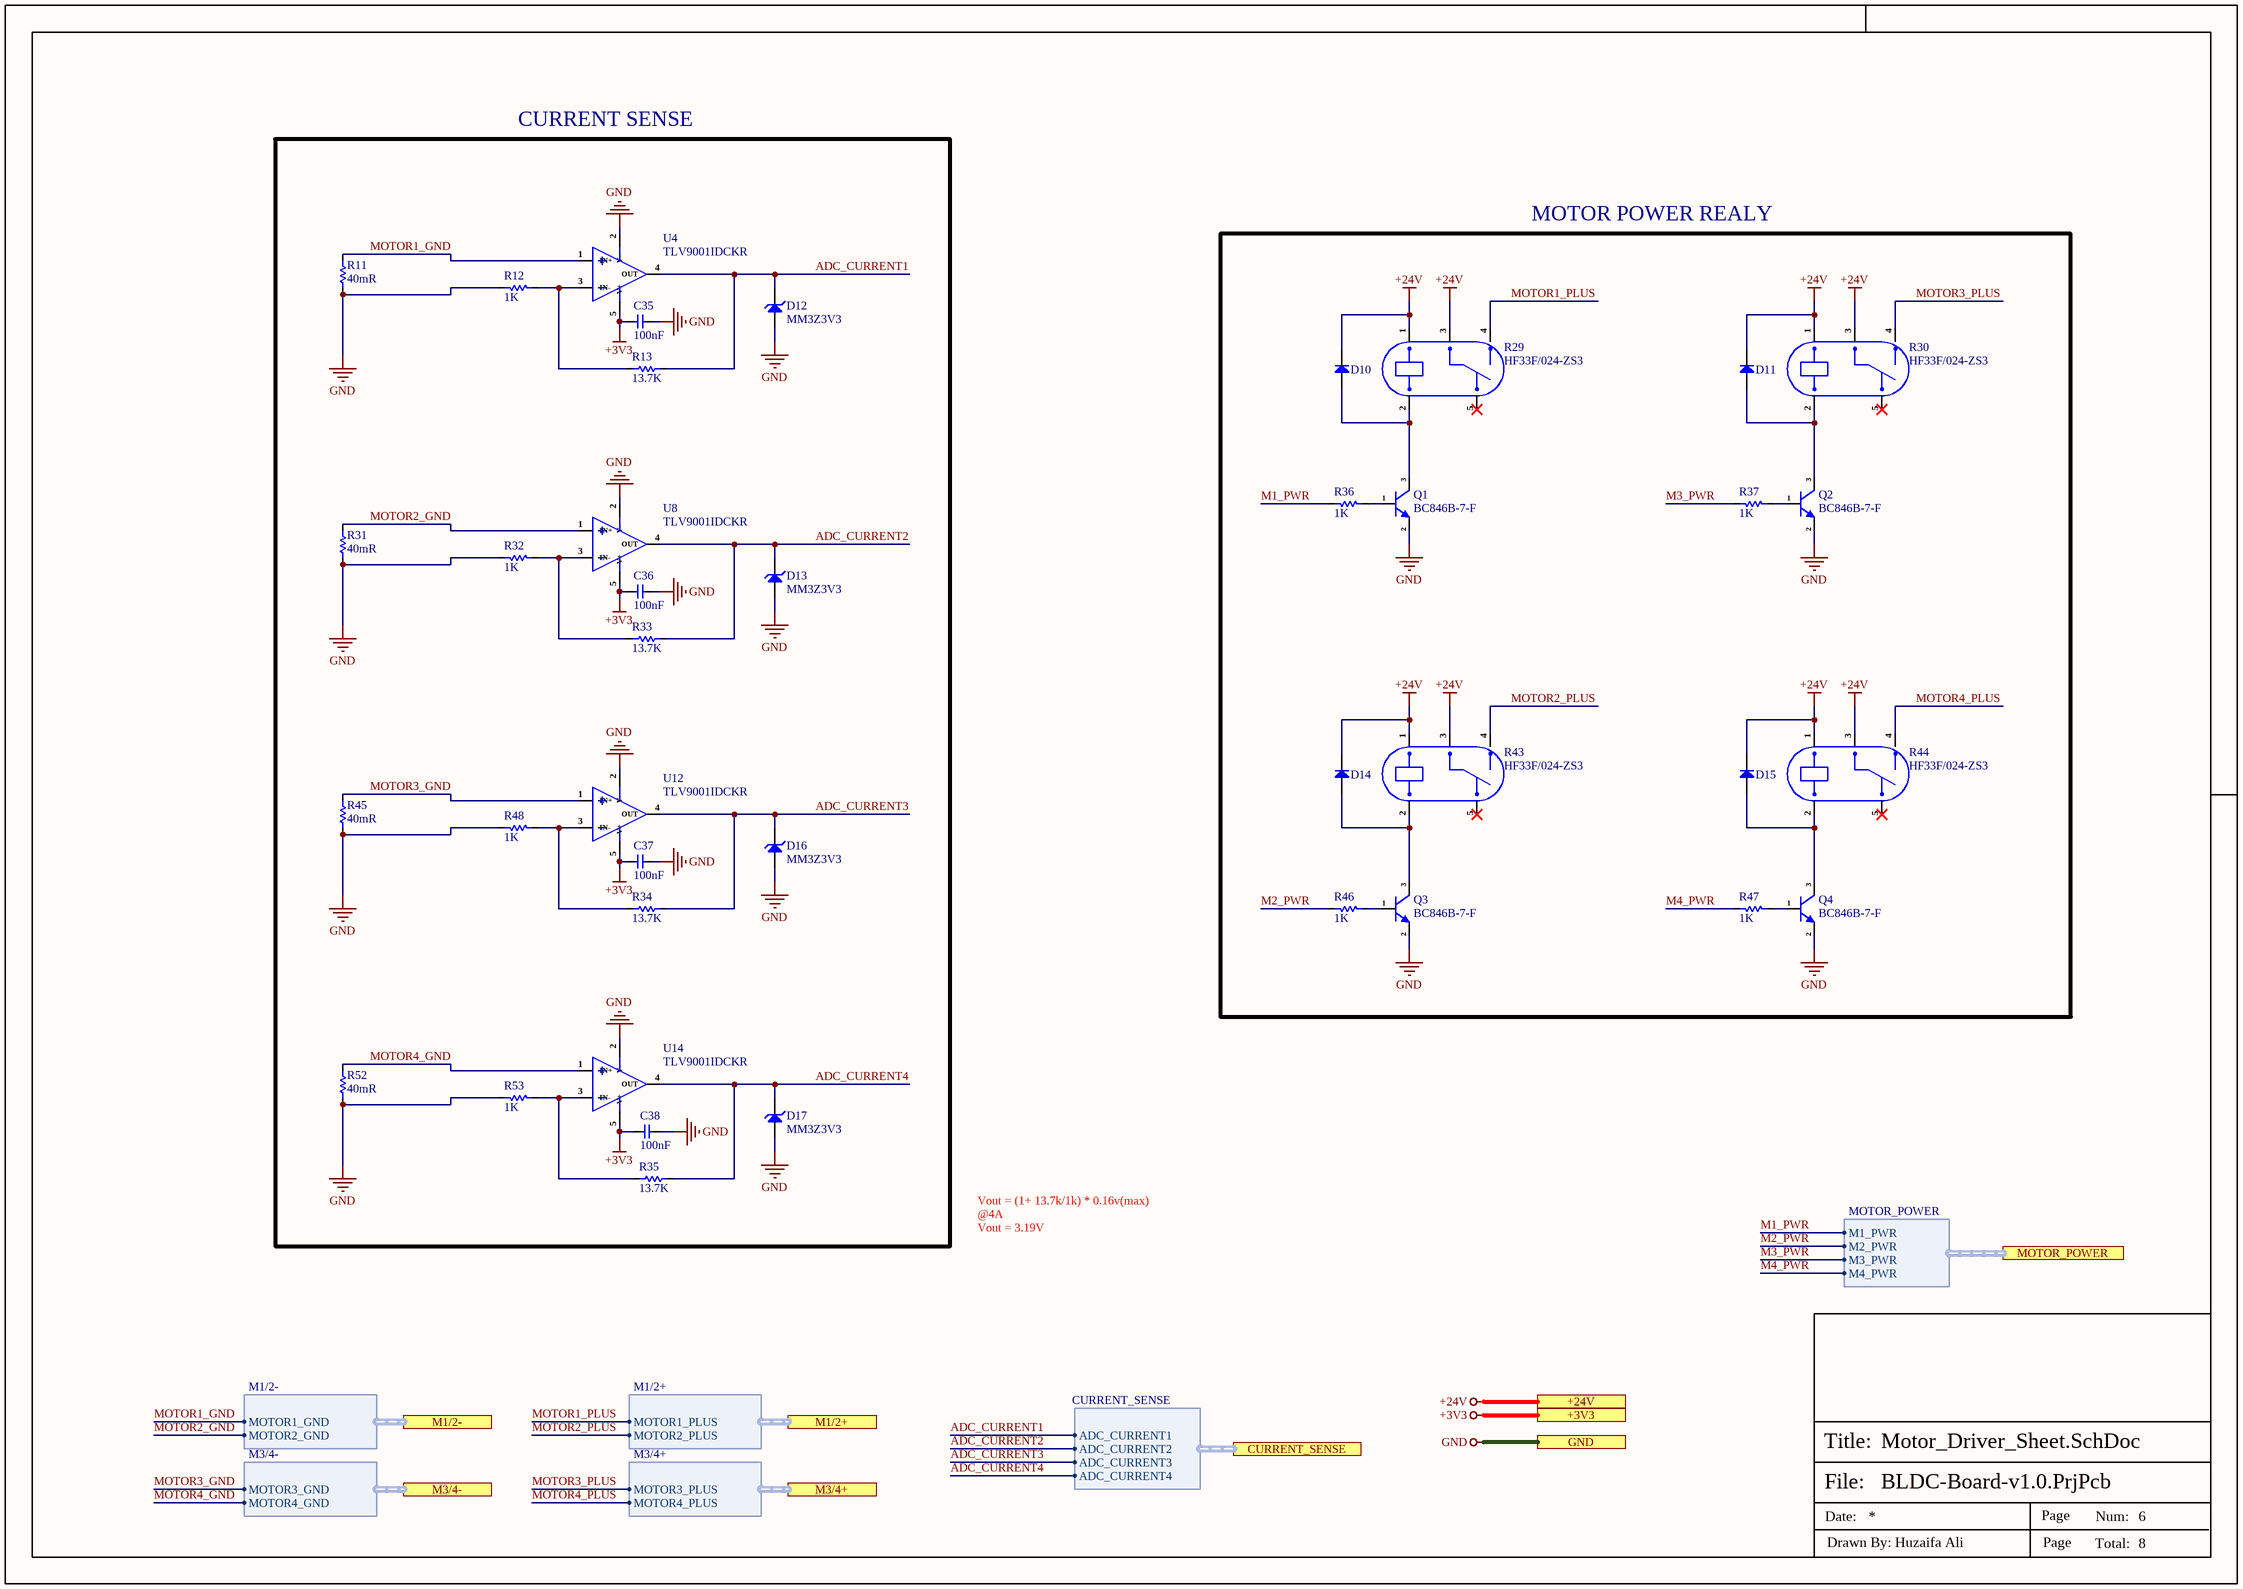
[diagram p5: Motor_Driver_Sheet.SchDoc]

### Parts
C35  100nF  [cap-0402]
C36  100nF  [cap-0402]
C37  100nF  [cap-0402]
C38  100nF  [cap-0402]
D10  1N4148WS-7-F  [SOD-323]  (value not drawn)
D11  1N4148WS-7-F  [SOD-323]  (value not drawn)
D12  MM3Z3V3  [SOD-323]
D13  MM3Z3V3  [SOD-323]
D14  1N4148WS-7-F  [SOD-323]  (value not drawn)
D15  1N4148WS-7-F  [SOD-323]  (value not drawn)
D16  MM3Z3V3  [SOD-323]
D17  MM3Z3V3  [SOD-323]
Q1  BC846B-7-F  [SOT-23]
Q2  BC846B-7-F  [SOT-23]
Q3  BC846B-7-F  [SOT-23]
Q4  BC846B-7-F  [SOT-23]
R11  40mR  [Res-1206]
R12  1K  [Res-0402]
R13  13.7K  [Res-0603]
R29  HF33F/024-ZS3  [HF33F/024-ZS3]
R30  HF33F/024-ZS3  [HF33F/024-ZS3]
R31  40mR  [Res-1206]
R32  1K  [Res-0402]
R33  13.7K  [Res-0603]
R34  13.7K  [Res-0603]
R35  13.7K  [Res-0603]
R36  1K  [Res-0402]
R37  1K  [Res-0402]
R43  HF33F/024-ZS3  [HF33F/024-ZS3]
R44  HF33F/024-ZS3  [HF33F/024-ZS3]
R45  40mR  [Res-1206]
R46  1K  [Res-0402]
R47  1K  [Res-0402]
R48  1K  [Res-0402]
R52  40mR  [Res-1206]
R53  1K  [Res-0402]
U4  TLV9001IDCKR  [SC-70-5]
U8  TLV9001IDCKR  [SC-70-5]
U12  TLV9001IDCKR  [SC-70-5]
U14  TLV9001IDCKR  [SC-70-5]

### Ports
+3V3 (see Top_Sheet[2C], CAN_Sheet[5D], Connector_Sheet1[5D], Connector_Sheet2[3D], Controller_Sheet[2D], Power_Sheet[5D], RS485_RS232_Sheet[5D]), +24V (see Top_Sheet[2B], Power_Sheet[5D]), CURRENT_SENSE (harness CURRENT_SENSE, see Top_Sheet[2C], Controller_Sheet[5D]), GND (see Top_Sheet[2C], CAN_Sheet[5D], Connector_Sheet1[5D], Connector_Sheet2[3D], Controller_Sheet[2D], Power_Sheet[5D], RS485_RS232_Sheet[5D]), M1/2+ (harness M1/2+, see Top_Sheet[2B], Connector_Sheet1[5D]), M1/2- (harness M1/2-, see Top_Sheet[2C], Connector_Sheet1[5D]), M3/4+ (harness M3/4+, see Top_Sheet[2C], Connector_Sheet2[5D]), M3/4- (harness M3/4-, see Top_Sheet[2C], Connector_Sheet2[5D]), MOTOR_POWER (harness MOTOR_POWER, see Top_Sheet[2C], Controller_Sheet[5D])

### Harnesses
M1/2+: MOTOR1_PLUS, MOTOR2_PLUS
M3/4+: MOTOR3_PLUS, MOTOR4_PLUS
M1/2-: MOTOR1_GND, MOTOR2_GND
M3/4-: MOTOR3_GND, MOTOR4_GND
CURRENT_SENSE: ADC_CURRENT1, ADC_CURRENT2, ADC_CURRENT3, ADC_CURRENT4
MOTOR_POWER: M1_PWR, M2_PWR, M3_PWR, M4_PWR

### Nets
+3V3: C35.2 C36.2 C37.2 C38.2 U4.5(V+) U8.5(V+) U12.5(V+) U14.5(V+) ; port +3V3
+24V: D10.1(K) D11.1(K) D14.1(K) D15.1(K) R29.1 R29.3 R30.1 R30.3 R43.1 R43.3 R44.1 R44.3 ; port +24V
GND: C35.1 C36.1 C37.1 C38.1 D12.2(A) D13.2(A) D16.2(A) D17.2(A) Q1.2(E) Q2.2(E) Q3.2(E) Q4.2(E) R11.1 R12.2 R31.1 R32.2 R45.1 R48.2 R52.1 R53.2 U4.2(V-) U8.2(V-) U12.2(V-) U14.2(V-) ; port GND
ADC_CURRENT1: D12.1(K) R13.2 U4.4(OUT) ; port CURRENT_SENSE.ADC_CURRENT1
ADC_CURRENT2: D13.1(K) R33.2 U8.4(OUT) ; port CURRENT_SENSE.ADC_CURRENT2
ADC_CURRENT3: D16.1(K) R34.2 U12.4(OUT) ; port CURRENT_SENSE.ADC_CURRENT3
ADC_CURRENT4: D17.1(K) R35.2 U14.4(OUT) ; port CURRENT_SENSE.ADC_CURRENT4
M1_PWR: R36.2 ; port MOTOR_POWER.M1_PWR
M2_PWR: R46.2 ; port MOTOR_POWER.M2_PWR
M3_PWR: R37.2 ; port MOTOR_POWER.M3_PWR
M4_PWR: R47.2 ; port MOTOR_POWER.M4_PWR
MOTOR1_GND: R11.2 U4.1(IN+) ; port M1/2-.MOTOR1_GND
MOTOR1_PLUS: R29.4 ; port M1/2+.MOTOR1_PLUS
MOTOR2_GND: R31.2 U8.1(IN+) ; port M1/2-.MOTOR2_GND
MOTOR2_PLUS: R43.4 ; port M1/2+.MOTOR2_PLUS
MOTOR3_GND: R45.2 U12.1(IN+) ; port M3/4-.MOTOR3_GND
MOTOR3_PLUS: R30.4 ; port M3/4+.MOTOR3_PLUS
MOTOR4_GND: R52.2 U14.1(IN+) ; port M3/4-.MOTOR4_GND
MOTOR4_PLUS: R44.4 ; port M3/4+.MOTOR4_PLUS
NetD10_2: D10.2(A) Q1.3(C) R29.2
NetD11_2: D11.2(A) Q2.3(C) R30.2
NetD14_2: D14.2(A) Q3.3(C) R43.2
NetD15_2: D15.2(A) Q4.3(C) R44.2
NetQ1_1: Q1.1(B) R36.1
NetQ2_1: Q2.1(B) R37.1
NetQ3_1: Q3.1(B) R46.1
NetQ4_1: Q4.1(B) R47.1
NetR12_1: R12.1 R13.1 U4.3(IN-)
NetR32_1: R32.1 R33.1 U8.3(IN-)
NetR34_1: R34.1 R48.1 U12.3(IN-)
NetR35_1: R35.1 R53.1 U14.3(IN-)

Not connected (* = marked no-connect by the designer): R29 5*; R30 5*; R43 5*; R44 5*

### Notes on the sheet
- CURRENT SENSE
- MOTOR POWER REALY
- Vout = (1+ 13.7k/1k) * 0.16v(max) @4A
  Vout = 3.19V
- File:
- Title:
- Date:
- Page
- Num:
- Total:
- Drawn By: Huzaifa Ali

### Library data of the parts
C35-C38 = C1005X7R1H104KT000F: as C9 on sheet Controller_Sheet; Supplier 1: Avnet; Manufacturer Part Number: C1005X7R1H104KT000F; RoHS: No; Category: Ceramic Capacitors; Dielectric: X7R; Supplier Part Number 1: C1005X7R1H104KT000F; LCSC Part Number: C361198; ComponentLink1Description: LCSC; ComponentLink1URL: https://www.lcsc.com/product-detail/Multilayer-Ceramic-Capacitors-MLCC-SMD-SMT_TDK-C1005X7R1H104KT000F_C361198.html
D10 D11 D14 D15 = 1N4148WS-7-F: DIODE GEN PURP 75V 150MA SOD323; Manufacturer: Diodes; Forward Current: 300mA; Reverse Recovery Time: 4ns; Element Configuration: Single; Forward Voltage: 1.25V; Max Reverse Current: 1uA; Peak Non-Repetitive Surge Current: 2A; Power Dissipation: 200mW; Polarity: Standard; Capacitance: 2pF; Supplier 1: Mouser; Manufacturer Part Number: 1N4148WS-7-F; RoHS: Yes; Category: Rectifier Diodes; Pricing 1: 1=0.19000, 10=0.17500, 50=0.17500, 100=0.09600, 500=0.05900, 1000=0.04000, 3000=0.03000, 9000=0.02600, 10000=0.02600, 24000=0.02300, 45000=0.01900 (USD); Mount: Surface Mount; Number of Pins: 2; Weight: 0.000173oz; Contact Plating: Tin,Matte; Min Operating Temperature: -65°C; Max Operating Temperature: 150°C; Max Repetitive Reverse Voltage (Vrrm): 75V; Max Forward Surge Current (Ifsm): 2A; Max Surge Current: 2A; Packaging: Tape and Reel; Recovery Time: 4ns; Package Quantity: 3000; Average Rectified Current: 150mA; Voltage Rating (DC): 75V; Power Rating: 200mW; Current Rating: 150mA; Output Current: 150mA; Voltage: 75V; Max Reverse Voltage (DC): 75V; Series: -; Reverse Recovery Time-Max: 4ns; Length: 1.8mm; Width: 1.4mm; Height: 1mm; Radiation Hardening: No; REACH SVHC: No SVHC; Lead Free: Lead Free; RoHS Compliant: Yes; ComponentLink1URL: https://datasheet.ciiva.com/1179/ds30097-1179355.pdf?src-supplier=Element14; ComponentLink1Description: https://datasheet.ciiva.com/1179/ds30097-1179355.pdf?src-supplier=Element14; ComponentLink2URL: https://datasheet.ciiva.com/8300/ds30097-8300396.pdf?src-supplier=Avnet; ComponentLink2Description: https://datasheet.ciiva.com/8300/ds30097-8300396.pdf?src-supplier=Avnet; ComponentLink3URL: https://datasheet.ciiva.com/16199/ds30097-16199061.pdf?src-supplier=Future+Electronics; ComponentLink3Description: https://datasheet.ciiva.com/16199/ds30097-16199061.pdf?src-supplier=Future+Electronics; ComponentLink4URL: https://datasheet.ciiva.com/911/ds30097-911742.pdf?src-supplier=Digi-Key; ComponentLink4Description: https://datasheet.ciiva.com/911/ds30097-911742.pdf?src-supplier=Digi-Key; ComponentLink5URL: https://datasheet.ciiva.com/911/ds30097-911743.pdf?src-supplier=Digi-Key; ComponentLink5Description: https://datasheet.ciiva.com/911/ds30097-911743.pdf?src-supplier=Digi-Key; ComponentLink6URL: https://datasheet.ciiva.com/911/ds30097-911741.pdf?src-supplier=Digi-Key; ComponentLink6Description: https://datasheet.ciiva.com/911/ds30097-911741.pdf?src-supplier=Digi-Key; Supplier Part Number 1: 621-1N4148WS-F; LCSC Part Number: C60580; Item Type: Diode
D12 D13 D16 D17 = MM3Z3V3: ±5% Single 3.1V~3.5V 300mW 3.3V SOD-323 Zener Diodes ROHS; Manufacturer: JSMSEMI; Item Type: Diode; ComponentLink1Description: LCSC; ComponentLink1URL: https://www.lcsc.com/product-detail/Zener-Diodes_Shandong-Jingdao-Microelectronics-MM3Z3V3_C123917.html; Manufacturer Part Number: MM3Z3V3; Package: SOD-323; LCSC Part Number: C123917
Q1-Q4 = BC846B-7-F: TRANS NPN 65V 0.1A SOT23-3; Manufacturer: Diodes; Item Type: Transistors; Supplier: Future Electronics; Supplier Part Number: 3888237; Manufacturer Part Number: BC846B-7-F; RoHS: Yes; Category: BJTs; Stock: 4416000; Pricing: 3000=0.0363, 12000=0.0348, 45000=0.0335, 120000=0.0325, 300000=0.0309 (USD); ComponentLink1URL: https://datasheet.ciiva.com/15139/getdatasheetpartid-139519-15139459.pdf?src-supplier=Verical; ComponentLink1Description: https://datasheet.ciiva.com/15139/getdatasheetpartid-139519-15139459.pdf?src-supplier=Verical; ComponentLink2URL: https://datasheet.ciiva.com/22711/1911717-22711685.pdf?src-supplier=Element14; ComponentLink2Description: https://datasheet.ciiva.com/22711/1911717-22711685.pdf?src-supplier=Element14; LCSC Part Number: C183643
R11 R31 R45 R52 = LR1206-21R040F4: 1W 40mΩ Surface Mount Current Sensing Resistors ±50ppm/℃ ±1% 1206 Current Sense Resistors/Shunt Resistors ROHS; Manufacturer: RALEC; Manufacturer Part Number: LR1206-21R040F4; Package: 1206; LCSC Part Number: C2681030; Item Type: Resistor; ComponentLink1Description: LCSC; ComponentLink1URL: https://www.lcsc.com/product-detail/Current-Sense-Resistors-Shunt-Resistors_RALEC-LR1206-21R040F4_C2681030.html
R12 R32 R36 R37 R46-R48 R53 = CRCW04021K00FKEDHP: RES SMD 1K OHM 1% 1/5W 0402; Manufacturer: Vishay Dale; Resistance: 1kR; Temperature Coefficient: 100ppm/°C; Power Rating: 125mW; Voltage Rating: 50V; Supplier 1: Digi-Key; Manufacturer Part Number: CRCW04021K00FKEDHP; Stock 1: 315989; Pricing 1: 1=0.15, 10=0.132, 100=0.0506, 1000=0.02226, 2500=0.01923, 5000=0.0172 (USD); Mount: Surface Mount; Case/Package: 0402; Number of Pins: 2; Contact Plating: Tin; Weight: 2.3E-05oz; Case Code (Imperial): 0402; Case Code (Metric): 1005; Size Code: 0402; Min Operating Temperature: -55°C; Max Operating Temperature: 155°C; Tolerance: 1%; Resistor Type: Thick Film; Package Quantity: 10; Packaging: Tape and Reel; Number of Terminations: 2; Termination: SMD/SMT; Max Power Dissipation: 125mW; Voltage Rating (DC): 50V; Features: Automotive AEC-Q200; Series: CRCW-HP; Construction: Rectangular; Technology: THICK FILM; Resistance Tolerance: 1%; Length: 1mm; Width: 0.5mm; Height: 0.3mm; Depth: 0.5mm; Radiation Hardening: No; REACH SVHC: Unknown; Military Standard: Not; Lead Free: Lead Free; RoHS Compliant: Yes; ComponentLink1URL: http://www.farnell.com/datasheets/2339608.pdf?src-supplier=Element14; ComponentLink1Description: http://www.farnell.com/datasheets/2339608.pdf?src-supplier=Element14; ComponentLink2URL: http://www.vishay.com/docs/20043/crcwhpe3.pdf?src-supplier=Digi-Key; ComponentLink2Description: http://www.vishay.com/docs/20043/crcwhpe3.pdf?src-supplier=Digi-Key; ComponentLink3URL: http://www.mouser.com/ds/2/427/crcwhpe3-46056.pdf?src-supplier=Mouser; ComponentLink3Description: http://www.mouser.com/ds/2/427/crcwhpe3-46056.pdf?src-supplier=Mouser; ComponentLink4URL: http://www.vishay.com/docs/20043/crcwhpe3.pdf?src-supplier=Avnet; ComponentLink4Description: http://www.vishay.com/docs/20043/crcwhpe3.pdf?src-supplier=Avnet; ComponentLink5URL: http://www.vishay.com/docs/20043/crcwhpe3.pdf?src-supplier=Future+Electronics; ComponentLink5Description: http://www.vishay.com/docs/20043/crcwhpe3.pdf?src-supplier=Future+Electronics; Supplier Part Number 1: 541-1.00KYCT-ND; LCSC Part Number: C313354
R13 R33-R35 = AT0603BRD0713K7L: RES SMD 13.7KOHM 0.1% 1/10W 0603; Manufacturer: Yageo; Value: 13.7kR; Max Power Dissipation: 100mW; Temperature Coefficient: 25ppm/°C; Item Type: Resistor; Supplier: Mouser; Supplier Part Number: 603-AT0603BRD0713K7L; Manufacturer Part Number: AT0603BRD0713K7L; RoHS: Yes; Category: Chip SMD Resistors; Stock: 2500; Pricing: 1=0.52, 10=0.396, 50=0.396, 100=0.167, 1000=0.092, 10000=0.075 (USD); Case/Package: 0603; Min Operating Temperature: -55°C; Max Operating Temperature: 155°C; Packaging: Tape and Reel; Number of Terminations: 2; Tolerance: 0.1%; Features: Moisture Resistant,Automotive AEC-Q200,Anti-Sulfur; Series: AT; Length: 0.063inch; Width: 0.032inch; Height: 0.022inch; RoHS Compliant: Yes; ComponentLink1URL: http://www.yageo.com/documents/recent/PYu-AT_51_RoHS_L-3.pdf?src-supplier=Digi-Key; ComponentLink1Description: http://www.yageo.com/documents/recent/PYu-AT_51_RoHS_L-3.pdf?src-supplier=Digi-Key; LCSC Part Number: C855608
R29 R30 R43 R44 = HF33F/024-ZS3: 24V 10A SPDT (1 Form C) Plugin,10.2x20.5mm Power Relays ROHS; Manufacturer: HF(Xiamen Hongfa Electroacoustic); Item Type: Relay; Manufacturer Part Number: HF33F/024-ZS3; Package: Plugin,10.2x20.5mm; LCSC Part Number: C36391; ComponentLink1Description: LCSC; ComponentLink1URL: https://www.lcsc.com/product-detail/Power-Relays_HF-Xiamen-Hongfa-Electroacoustic-HF33F-024-ZS3_C36391.html
U4 U8 U12 U14 = TLV9001IDCKR: IC CMOS 1 CIRCUIT SC70-5; Manufacturer: Texas Instruments; Number of Channels: 1; Slew Rate: 2V/µs; Gain Bandwidth Product: 1MHz; Input Bias Current: 5pA; Input Offset Voltage (Vos): 400uV; Operating Supply Current: 60uA; Output Current per Channel: 40mA; Supplier: Mouser; Supplier Part Number: 595-TLV9001IDCKR; Manufacturer Part Number: TLV9001IDCKR; RoHS: Yes; Item Type: IC; Stock: 13115; Pricing: 1=0.47, 10=0.348, 50=0.348, 100=0.194, 1000=0.146, 10000=0.117 (USD); Mounting Technology: Surface Mount; Min Operating Temperature: -40°C; Max Operating Temperature: 125°C; Packaging: Cut Tape; Number of Circuits: 1; Series: -; RoHS Compliant: Yes; ComponentLink1URL: http://www.ti.com/lit/ds/symlink/tlv9001.pdf?src-supplier=Digikey; ComponentLink1Description: http://www.ti.com/lit/ds/symlink/tlv9001.pdf?src-supplier=Digikey; LCSC Part Number: C398362